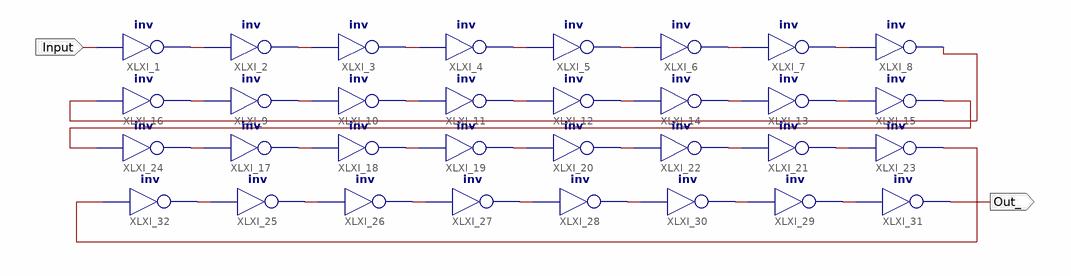
[diagram p0: schematic sheet 1]
// Xilinx ISE schematic delay8.sch (spartan6) as structural Verilog: 32 symbols, 2 ports
module delay8 (
  input  Input,
  output Out_
);

  wire Output, XLXN_1, XLXN_2, XLXN_3, XLXN_4, XLXN_5, XLXN_6, XLXN_13, XLXN_14, XLXN_15, XLXN_16, XLXN_17,
       XLXN_18, XLXN_19, XLXN_20, XLXN_21, XLXN_22, XLXN_23, XLXN_24, XLXN_25, XLXN_26, XLXN_27, XLXN_28,
       XLXN_29, XLXN_30, XLXN_31, XLXN_32, XLXN_33, XLXN_34, XLXN_36, XLXN_37;

  not XLXI_1 (XLXN_1, Input);
  not XLXI_2 (XLXN_2, XLXN_1);
  not XLXI_3 (XLXN_3, XLXN_2);
  not XLXI_4 (XLXN_13, XLXN_3);
  not XLXI_5 (XLXN_4, XLXN_13);
  not XLXI_8 (Output, XLXN_6);
  not XLXI_7 (XLXN_6, XLXN_5);
  not XLXI_6 (XLXN_5, XLXN_4);
  not XLXI_9 (XLXN_15, XLXN_14);
  not XLXI_10 (XLXN_16, XLXN_15);
  not XLXI_11 (XLXN_20, XLXN_16);
  not XLXI_12 (XLXN_19, XLXN_20);
  not XLXI_13 (XLXN_17, XLXN_18);
  not XLXI_14 (XLXN_18, XLXN_19);
  not XLXI_15 (XLXN_36, XLXN_17);
  not XLXI_16 (XLXN_14, Output);
  not XLXI_17 (XLXN_22, XLXN_21);
  not XLXI_18 (XLXN_23, XLXN_22);
  not XLXI_19 (XLXN_27, XLXN_23);
  not XLXI_20 (XLXN_26, XLXN_27);
  not XLXI_21 (XLXN_24, XLXN_25);
  not XLXI_22 (XLXN_25, XLXN_26);
  not XLXI_23 (XLXN_37, XLXN_24);
  not XLXI_24 (XLXN_21, XLXN_36);
  not XLXI_25 (XLXN_29, XLXN_28);
  not XLXI_26 (XLXN_30, XLXN_29);
  not XLXI_27 (XLXN_34, XLXN_30);
  not XLXI_28 (XLXN_33, XLXN_34);
  not XLXI_29 (XLXN_31, XLXN_32);
  not XLXI_30 (XLXN_32, XLXN_33);
  not XLXI_31 (Out_, XLXN_31);
  not XLXI_32 (XLXN_28, XLXN_37);
endmodule
